# Altium schematic sheet connectors.SchDoc
size A; SheetNumber: 1; SheetTotal: 1
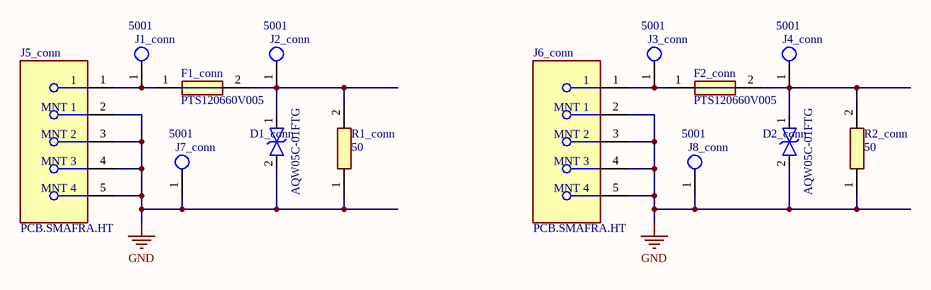
[diagram p0: connectors.SchDoc]

## Parts
D1_conn  AQW05C-01FTG  [SOD2613X100N]
D2_conn  AQW05C-01FTG  [SOD2613X100N]
F1_conn  PTS120660V005  [FUSC3216X90N]
F2_conn  PTS120660V005  [FUSC3216X90N]
J1_conn  5001  [FP-5001-MFG]
J2_conn  5001  [FP-5001-MFG]
J3_conn  5001  [FP-5001-MFG]
J4_conn  5001  [FP-5001-MFG]
J5_conn  PCB.SMAFRA.HT  [FP-PCB_SMAFRA_HT-MFG]
J6_conn  PCB.SMAFRA.HT  [FP-PCB_SMAFRA_HT-MFG]
J7_conn  5001  [FP-5001-MFG]
J8_conn  5001  [FP-5001-MFG]
R1_conn  50  [RESC6332X65N]
R2_conn  50  [RESC6332X65N]

## Nets
GND: D1_conn.2 D2_conn.2 J5_conn.2(MNT_1) J5_conn.3(MNT_2) J5_conn.4(MNT_3) J5_conn.5(MNT_4) J6_conn.2(MNT_1) J6_conn.3(MNT_2) J6_conn.4(MNT_3) J6_conn.5(MNT_4) J7_conn.1 J8_conn.1 R1_conn.1 R2_conn.1
NetD1_conn_1: D1_conn.1 F1_conn.2 J2_conn.1 R1_conn.2
NetD2_conn_1: D2_conn.1 F2_conn.2 J4_conn.1 R2_conn.2
NetF1_conn_1: F1_conn.1 J1_conn.1 J5_conn.1
NetF2_conn_1: F2_conn.1 J3_conn.1 J6_conn.1

## Library data of the parts
D1_conn D2_conn = AQW05C-01FTG: TVS Diode (Bi-directional); Manufacturer_Name: LITTELFUSE; Datasheet Link: https://www.littelfuse.com/media?resourcetype=datasheets&itemid=80ae0bbb-a157-46a1-97eb-84c82c82e9e5&filename=littelfuse-tvs-diode-array-aqw05c-01ftg-datasheet; Height: 1mm; Manufacturer_Part_Number: AQW05C-01FTG; Mouser Part Number: 576-AQW05C-01FTG; Mouser Price/Stock: https://www.mouser.co.uk/ProductDetail/Littelfuse/AQW05C-01FTG?qs=Z%252BL2brAPG1JHH8XKoKQPyw%3D%3D
F1_conn F2_conn = PTS120660V005: Fuse; Manufacturer_Name: Eaton; Datasheet Link: https://in.element14.com/eaton-bussmann-series/pts120660v005/pptc-resettable-fuse-0-05a-60vdc/dp/2929344?srsltid=AfmBOorX1B25_1GKuczfUlW7ilxwoZgl3KmxHJmMFzJpoWYAJ50DmC3S; Height: 0.9mm; Manufacturer_Part_Number: PTS120660V005; Mouser Part Number: 504-PTS120660V005; Mouser Price/Stock: https://www.mouser.co.uk/ProductDetail/Eaton-Electronics/PTS120660V005?qs=QmibqUXyDhQPirhmCJ6OpQ%3D%3D; Arrow Part Number: PTS120660V005; Arrow Price/Stock: https://www.arrow.com/en/products/pts120660v005/eaton?region=europe
J1_conn J2_conn J3_conn J4_conn J7_conn J8_conn = CMP-2000-05181-2: PC TEST POINT MINIATURE BLACK; Body Material: Bronze; Plating: Silver; Inside Diameter: 1.27mm; Hole Diameter: 1.6mm; Number of Ports: 1; Outside Diameter: 2.54mm; Insulation: Insulated; Insulation Material: Nylon; Mount: Through Hole; RoHS Compliant: Yes; Series: THM; Height: 0.3inch; Termination: Through Hole; Material: Nylon; Packaging: Bulk; Contact Material: Bronze; REACH SVHC: No SVHC; Contact Plating: Silver; Orientation: Straight; Lead Free: Lead Free; Package Quantity: 100; Length: 7.62mm; Flammability Rating: UL94 V-0; Number of Contacts: 1; Diameter: 2.54mm; Housing Color: Black; Color: Black
J5_conn J6_conn = CMP-111093-000003-1: CONN SMA JACK R/A 50OHM PCB; Dielectric Material: PTFE; Max Frequency: 6GHz; Body Material: Brass; Center Contact Plating: Gold; Voltage Rating: 500V; Operating Frequency: 0 to 6 GHz; Number of Ports: 1; Impedance: 50R; Housing Color: Gold; Mount: Through Hole; Orientation: Right Angle; Termination: Solder; Contact Material: Brass; Series: -; Contact Plating: Gold; Fastening Type: Threaded; Connector Type: SMA; Package Quantity: 500; Case/Package: SMA; Body Plating: Gold; Frequency: 6GHz; Packaging: Tray
R1_conn R2_conn = RNCL2512FT50R0: Resistor; Manufacturer_Name: Stackpole Electronics; Datasheet Link: https://www.seielect.com/catalog/sei-rncl.pdf; Height: 0.65mm; Manufacturer_Part_Number: RNCL2512FT50R0; Resistance: 50